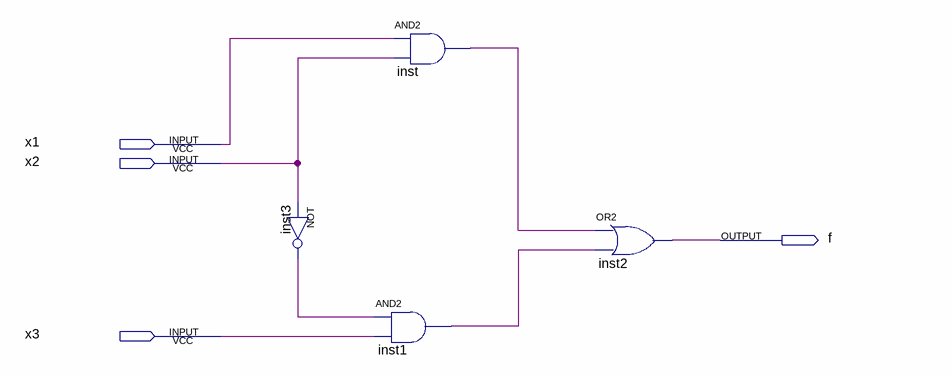
[diagram p0: schematic sheet]
// Quartus schematic Lab1 Tutorial.bdf as structural Verilog: 4 symbols, 4 pins
module \Lab1_Tutorial  (
  input  x1,
  input  x2,
  input  x3,
  output f
);

  wire inst1_out, inst3_out, inst_out;

  not inst3 (inst3_out, x2);
  and inst (inst_out, x1, x2);
  and inst1 (inst1_out, inst3_out, x3);
  or inst2 (f, inst_out, inst1_out);
endmodule
